# Altium schematic sheet SensorBoard.SchDoc
size A4; SheetNumber: 4; SheetTotal: 4
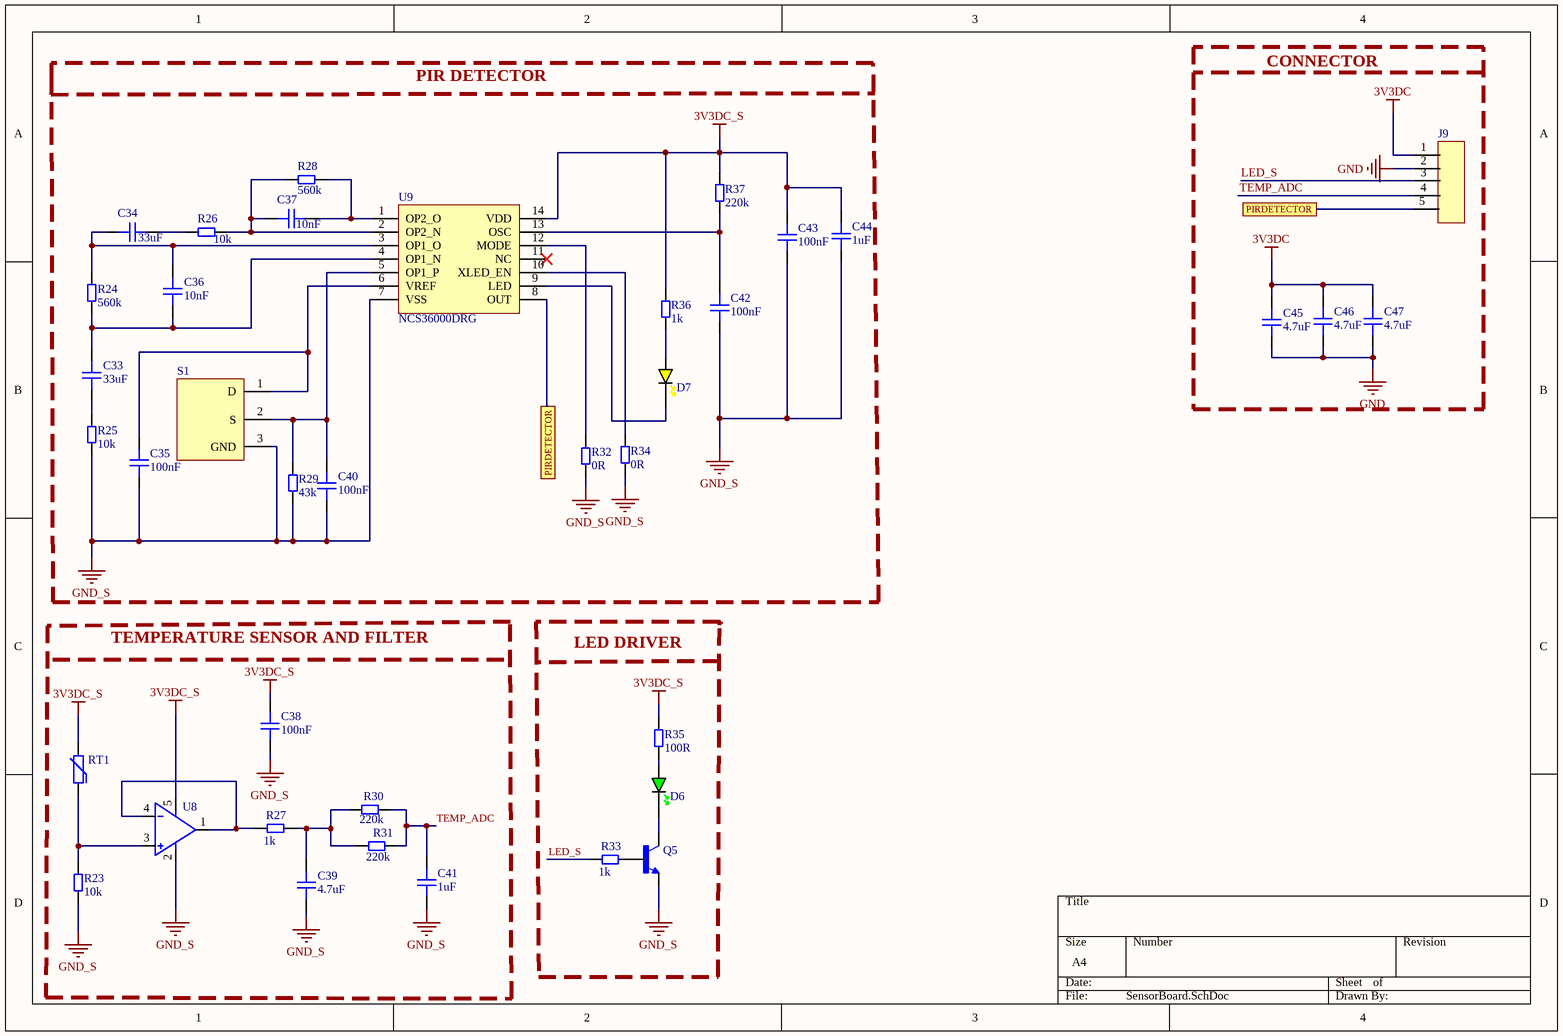
[diagram p0: SensorBoard.SchDoc]

## Parts
C33  33uF  [CAP_0603]
C34  33uF  [CAP_0603]
C35  100nF  [CAP_0603]
C36  10nF  [CAP_0603]
C37  10nF  [CAP_0603]
C38  100nF  [CAP_0603]
C39  4.7uF  [CAP_0603]
C40  100nF  [CAP_0603]
C41  1uF  [CAP_0603]
C42  100nF  [CAP_0603]
C43  100nF  [CAP_0603]
C44  1uF  [CAP_0603]
C45  4.7uF  [CAP_0603]
C46  4.7uF  [CAP_0603]
C47  4.7uF  [CAP_0603]
D6  GREEN  [LED_0603_GREEN]  (value not drawn)
D7  YELLOW  [LED_0603_YELLOW]  (value not drawn)
J9  Terminal_Block_Header  [HEADER_5]  (value not drawn)
Q5  BC237  [BC237]  (value not drawn)
R23  10k  [RES-0805]
R24  560k  [RES-0805]
R25  10k  [RES-0805]
R26  10k  [RES-0805]
R27  1k  [RES-0805]
R28  560k  [RES-0805]
R29  43k  [RES-0805]
R30  220k  [RES-0805]
R31  220k  [RES-0805]
R32  0R  [RES-0805]
R33  1k  [RES-0805]
R34  0R  [RES-0805]
R35  100R  [RES-0805]
R36  1k  [RES-0805]
R37  220k  [RES-0805]
RT1  TFPT1206L1002FM  [RES_1206]  (value not drawn)
S1  LHI 878/3902  [LHI 878]  (value not drawn)
U8  OPA314AIDBVR  [SOT-23-5]  (value not drawn)
U9  NCS36000DRG  [SOIC-14]

## Blocks framed on the sheet
CONNECTOR: C45-C47 J9
TEMPERATURE SENSOR AND FILTER: C38 C39 C41 R23 R27 R30 R31 RT1 U8
LED DRIVER: D6 Q5 R33 R35

## Ports
PIRDETECTOR

## Nets
3V3DC: C45.2 C46.2 C47.2 J9.1
3V3DC_S: C38.2 C43.2 C44.2 R35.1 R36.1 R37.1 RT1.2 U8.5 U9.14(VDD)
GND: C45.1 C46.1 C47.1 J9.2
GND_S: C35.2 C38.1 C39.1 C40.2 C41.1 C42.1 C43.1 C44.1 Q5.1(E) R23.1 R25.1 R29.1 R32.2 R34.2 S1.3(GND) U8.2 U9.7(VSS)
LED_S: J9.3 R33.2
PIRDETECTOR: J9.5 U9.8(OUT) ; port PIRDETECTOR
TEMP_ADC: C41.2 J9.4 R30.1 R31.1
NetC33_1: C33.1 C36.2 R24.1 U9.4(OP1_N)
NetC33_2: C33.2 R25.2
NetC34_1: C34.1 R26.1
NetC34_2: C34.2 C36.1 R24.2 U9.3(OP1_O)
NetC35_1: C35.1 S1.1(D) U9.6(VREF)
NetC37_1: C37.1 R28.2 U9.1(OP2_O)
NetC37_2: C37.2 R26.2 R28.1 U9.2(OP2_N)
NetC39_2: C39.2 R27.1 R30.2 R31.2
NetC40_1: C40.1 R29.2 S1.2(S) U9.5(OP1_P)
NetC42_2: C42.2 R37.2 U9.13(OSC)
NetD6_A: D6.A R35.2
NetD6_K: D6.K Q5.3(C)
NetD7_A: D7.A R36.2
NetD7_K: D7.K U9.9(LED)
NetQ5_2: Q5.2(B) R33.1
NetR23_2: R23.2 RT1.1 U8.3
NetR27_2: R27.2 U8.1 U8.4
NetR32_1: R32.1 U9.12(MODE)
NetR34_1: R34.1 U9.10(XLED_EN)

Not connected (* = marked no-connect by the designer): U9 11(NC)*

## Notes on the sheet
- PIR DETECTOR

## Library data of the parts
C33-C47 = CAP_0603_10V: Capacitor SMD 0603 10V; Deisgner: ZehraOzkan
D6 = LED_0603_GREEN: LED 0603 GREEN SMD; Designer: ZehraOzkan
D7 = LED_0603_YELLOW: LED 0603 YELLOW SMD; Designer: ZehraOzkan
J9 = Terminal_Block_Header: 5 pin Female; Designer: ZehraOzkan
Q5 = BC237: Transistor NPN BC237B MOTOROLA milliampere=100 V=45 R204; Manufacturer: ON Semiconductor / Fairchild; Voltage Rating (DC): 45V; hFE Min: 200; Max Power Dissipation: 500mW; Max Collector Current: 100mA; Transition Frequency: 250MHz; Collector Base Voltage (VCBO): 50V; Emitter Base Voltage (VEBO): 6V; Element Configuration: Single; Gain Bandwidth Product: 200MHz; Collector Emitter Saturation Voltage: 200mV; Collector-emitter Voltage-Max: 600mV; Number of Elements: 1; Designer: ZehraOzkan; Supplier 1: Avnet; Manufacturer Part Number: BC237B; RoHS: No; Category: BJTs; Stock 1: 16416; Pricing 1: 8013=0,04618, 8100=0,04493, 17000=0,04368, 41000=0,04243, 81000=0,04118, 410000=0,03994, 810000=0,03869 (USD); Mount: Through Hole; Case/Package: TO-92-3; Number of Pins: 3; Min Operating Temperature: -55°C; Max Operating Temperature: 150°C; Package Quantity: 2000; Packaging: Bulk; Collector Emitter Voltage (VCEO): 45V; Polarity: NPN; Collector Emitter Breakdown Voltage: 45V; Current Rating: 100mA; Series: -; Frequency: 250MHz; Power Dissipation: 500mW; Lead Free: Lead Free; RoHS Compliant: No; ComponentLink1URL: https://datasheet.ciiva.com/982/bc23x-982404.pdf?src-supplier=Digi-Key; ComponentLink1Description: https://datasheet.ciiva.com/982/bc23x-982404.pdf?src-supplier=Digi-Key; Supplier Part Number 1: BC237B
R23-R37 = RES-0805-10k: Res SMD 0805 10K 1% 0.125W T.C.100PPM; Manufacturer: Yageo; Manufacturer Part Number: RC0805FR-0710KL; Resistance: 10kR; Temperature Coefficient: 100ppm/°C; Power Rating: 125mW; Voltage Rating: 150V; Designer: ZehraOzkan; Supplier 1: Digi-Key; RoHS: Yes; Category: Chip SMD Resistors; Stock 1: 1272565; Pricing 1: 5000=0,00544 (USD); Case/Package: 0805; Case Code (Imperial): 0805; Case Code (Metric): 2012; Size Code: 0805; Min Operating Temperature: -55°C; Max Operating Temperature: 155°C; Tolerance: 1%; Resistor Type: Thick Film; Packaging: Tape and Reel; Package Quantity: 1; Termination: SMD/SMT; Number of Terminations: 2; Max Power Dissipation: 125mW; Features: Moisture Resistant; Series: RC; Construction: Rectangular; Resistance Tolerance: 1%; Technology: THICK FILM; Length: 2mm; Width: 0.049inch; Height: 0.024inch; Depth: 1.25mm; REACH SVHC: Unknown; Lead Free: Lead Free; Military Standard: Not; RoHS Compliant: Yes; Supplier Part Number 1: 311-10.0KCRTR-ND
RT1 = TFPT1206L1002FM: Thermistor PTC 10K Ohm 1% 2-Pin 1206 Surface Mount Solder Pad T/R Automotive; Manufacturer: Vishay Dale; Resistance: 10kR; Power Rating: 125mW; Voltage: 40V; Designer: ZehraOzkan; Supplier 1: Digi-Key; Manufacturer Part Number: TFPT1206L1002FM; RoHS: Yes; Category: Thermistors; Pricing 1: 1=1,35, 5=1,296, 10=1,054, 25=0,9076, 50=0,7862, 100=0,7133, 500=0,59978, 1000=0,53495 (USD); Mount: Surface Mount; Case/Package: 1206; Case Code (Imperial): 1206; Min Operating Temperature: -55°C; Max Operating Temperature: 125°C; Packaging: Tape and Reel; Package Quantity: 5000; Tolerance: 1%; Max Power Dissipation: 125mW; Termination: SMD/SMT; Series: TFPT; Resistance Tolerance: 1%; Length: 3.2mm; Width: 1.6mm; Height: 0.55mm; Lead Free: Lead Free; RoHS Compliant: Yes; ComponentLink1URL: https://datasheet.ciiva.com/2852/tfpt-2852076.pdf?src-supplier=Digi-Key; ComponentLink1Description: https://datasheet.ciiva.com/2852/tfpt-2852076.pdf?src-supplier=Digi-Key; Supplier Part Number 1: 541-3533-1-ND
S1 = LHI 878/3902: SENSOR PYRO DETECTOR DUAL MOTION; Manufacturer: Excelitas; Designer: ZehraOzkan; Supplier 1: Newark; Manufacturer Part Number: LHI878/3902; RoHS: No; Supplier Part Number 1: 61T6571
U8 = OPA314AIDBVR: IC OPAMP GP 3MHZ RRO SOT23-5; Manufacturer: Texas Instruments; Min Supply Voltage: 1.8V; Max Supply Voltage: 5.5V; Min Dual Supply Voltage: 900mV; Max Dual Supply Voltage: 2.75V; Voltage Gain: 128dB; Common Mode Rejection Ratio: 75dB; Output Current: 20mA; Number of Channels: 1; Slew Rate: 1.5V/µs; Max I/O Voltage: 2.5mV; Input Bias Current: 10pA; Operating Supply Current: 150uA; Power Supply Rejection Ratio (PSRR): 78dB; Amplifier Type: GENERAL PURPOSE; Designer: ZehraOzkan; Supplier 1: Digi-Key; Manufacturer Part Number: OPA314AIDBVR; RoHS: Yes; Category: Amplifiers - Op Amps, Buffer, Instrumentation; Pricing 1: 1=1,21, 10=1,085, 25=1,03, 100=0,846, 250=0,7908, 500=0,69886, 1000=0,55173 (USD); Case/Package: SOT-23-5; Number of Pins: 5; Min Operating Temperature: -40°C; Max Operating Temperature: 125°C; Gain Bandwidth Product: 3MHz; Package Quantity: 1; Packaging: Tape and Reel; Unity Gain Bandwidth Product: 3MHz; Nominal Gain Bandwidth Product: 3MHz; Input Offset Voltage (Vos): 2.5mV; Number of Circuits: 1; Output Current per Channel: 20mA; Number of Elements: 1; Supply Current: 150uA; Series: -; Technology: CMOS; Radiation Hardening: No; Lead Free: Lead Free; RoHS Compliant: Yes; ComponentLink1URL: https://datasheet.ciiva.com/29638/opa314-29638827.pdf?src-supplier=Digi-Key; ComponentLink1Description: https://datasheet.ciiva.com/29638/opa314-29638827.pdf?src-supplier=Digi-Key; ComponentLink2URL: https://datasheet.ciiva.com/14462/opa2314-14462006.pdf?src-supplier=Avnet; ComponentLink2Description: https://datasheet.ciiva.com/14462/opa2314-14462006.pdf?src-supplier=Avnet; ComponentLink3URL: https://datasheet.ciiva.com/14456/opa2314-14456281.pdf?src-supplier=Avnet; ComponentLink3Description: https://datasheet.ciiva.com/14456/opa2314-14456281.pdf?src-supplier=Avnet; Supplier Part Number 1: 296-36699-1-ND
U9 = NCS36000DRG: NCS36000 Series Single 5.75V Passive Infrared Detector Controller (PIR) -SOIC-14; Manufacturer: ON Semiconductor; Operating Supply Current: 50uA; Quiescent Current: 20uA; Min Supply Voltage: 3V; Output Type: Digital; Designer: ZehraOzkan; Supplier 1: Digi-Key; Manufacturer Part Number: NCS36000DRG; RoHS: Yes; Category: Amplifiers - Op Amps, Buffer, Instrumentation; Stock 1: 18690; Pricing 1: 1=1,04, 10=0,934, 25=0,8864, 100=0,728, 250=0,68052, 500=0,60138, 1000=0,47477 (USD); Case/Package: SOIC; Number of Pins: 14; Min Operating Temperature: -40°C; Max Operating Temperature: 85°C; Package Quantity: 3000; Packaging: Tape and Reel; Max Supply Voltage: 5.75V; Series: -; Input Type: DIGITAL; Length: 8.75mm; Width: 4mm; Height: 1.5mm; Radiation Hardening: No; Reach SVHC Compliant: No; Lead Free: Lead Free; Halogen Free: Halogen Free; RoHS Compliant: Yes; ComponentLink1URL: https://datasheet.ciiva.com/1781/ncs36000-d-1781637.pdf?src-supplier=Digi-Key; ComponentLink1Description: https://datasheet.ciiva.com/1781/ncs36000-d-1781637.pdf?src-supplier=Digi-Key; ComponentLink2URL: https://datasheet.ciiva.com/4763/ncs36000-d-89569-4763639.pdf?src-supplier=Mouser; ComponentLink2Description: https://datasheet.ciiva.com/4763/ncs36000-d-89569-4763639.pdf?src-supplier=Mouser; ComponentLink3URL: https://datasheet.ciiva.com/1781/ncs36000-d-1781638.pdf?src-supplier=Digi-Key; ComponentLink3Description: https://datasheet.ciiva.com/1781/ncs36000-d-1781638.pdf?src-supplier=Digi-Key; ComponentLink4URL: https://datasheet.ciiva.com/1781/ncs36000-d-1781639.pdf?src-supplier=Digi-Key; ComponentLink4Description: https://datasheet.ciiva.com/1781/ncs36000-d-1781639.pdf?src-supplier=Digi-Key; ComponentLink5URL: https://datasheet.ciiva.com/2965/ncs36000-d-2965212.pdf?src-supplier=Avnet; ComponentLink5Description: https://datasheet.ciiva.com/2965/ncs36000-d-2965212.pdf?src-supplier=Avnet; ComponentLink6URL: https://datasheet.ciiva.com/2966/ncs36000-d-2966525.pdf?src-supplier=Avnet; ComponentLink6Description: https://datasheet.ciiva.com/2966/ncs36000-d-2966525.pdf?src-supplier=Avnet; Supplier Part Number 1: NCS36000DRGOSCT-ND